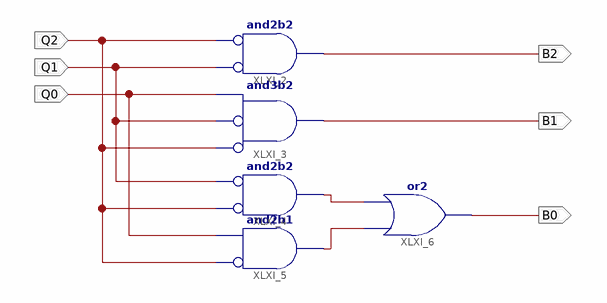
[diagram p0: schematic sheet 1]
// Xilinx ISE schematic dekoder.sch (spartan3e) as structural Verilog: 5 symbols, 6 ports
module dekoder (
  input  Q1,
  input  Q0,
  input  Q2,
  output B1,
  output B2,
  output B0
);

  wire XLXN_33, XLXN_34;

  or XLXI_6 (B0, XLXN_34, XLXN_33);
  and XLXI_2 (B2, ~Q1, ~Q2);  // and2b2
  and XLXI_3 (B1, ~Q2, ~Q1, Q0);  // and3b2
  and XLXI_4 (XLXN_33, ~Q2, ~Q1);  // and2b2
  and XLXI_5 (XLXN_34, ~Q2, Q0);  // and2b1
endmodule
